# EAGLE design bits (EAGLE 7.6.0)
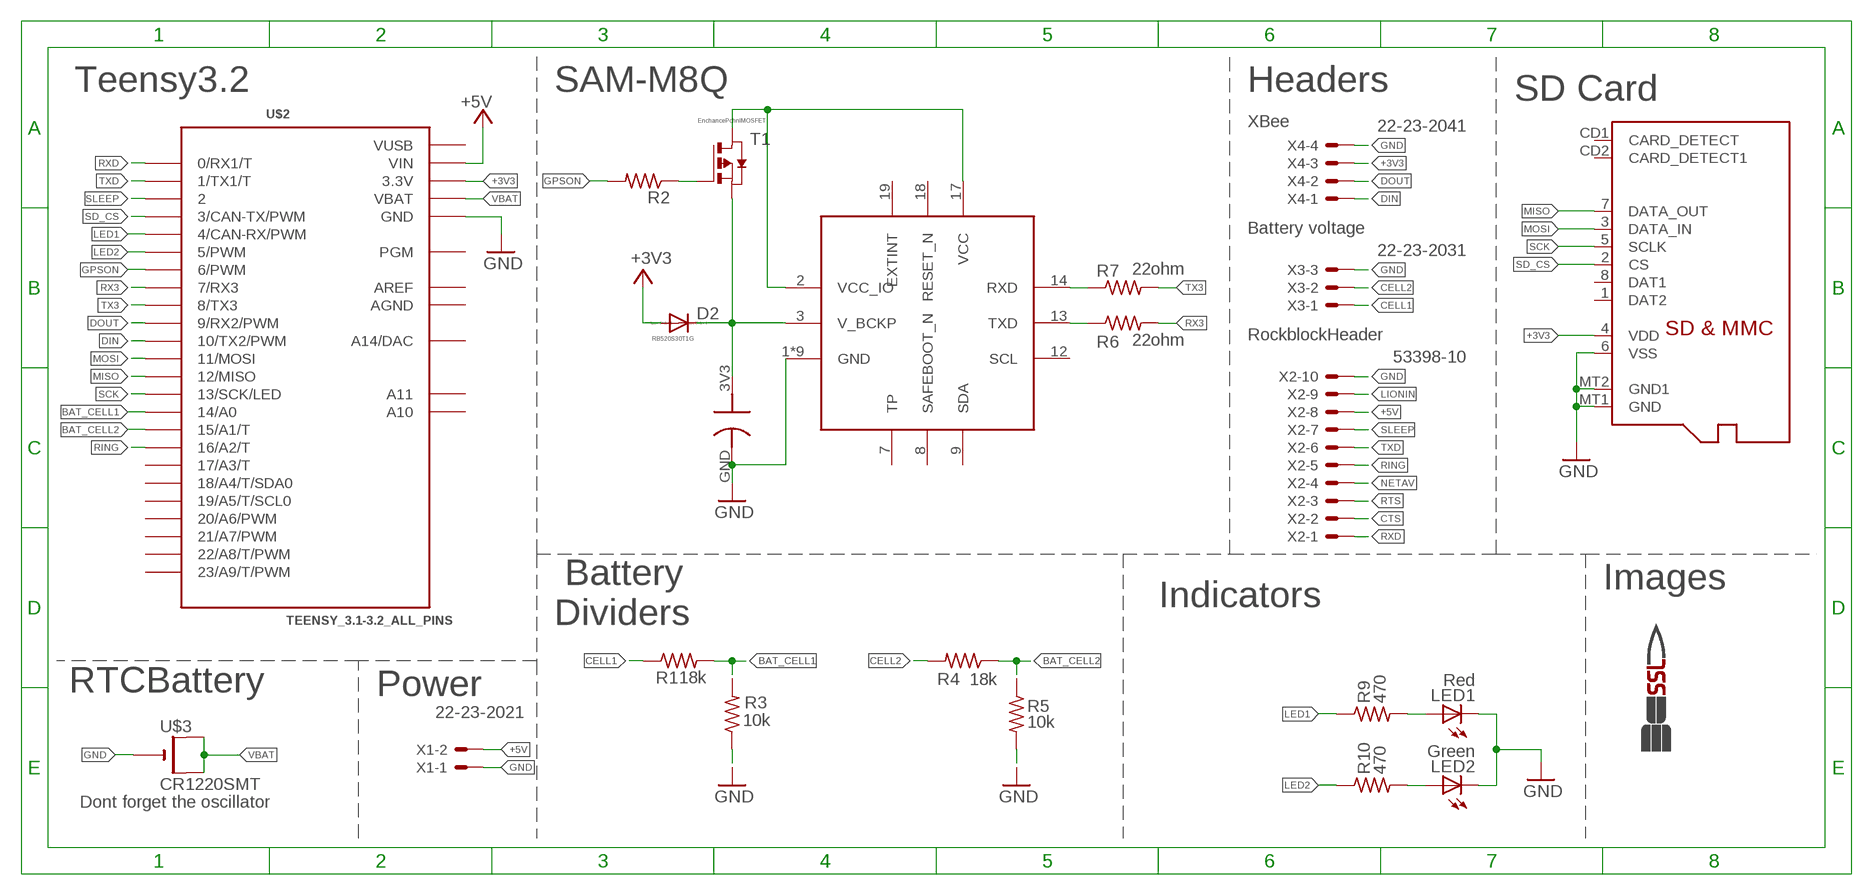
[diagram p0: schematic, sheet 1]

## Parts
C1  0.2F elna supercap  DCK-3RE204T614-ES  [ELNASUPERCAP]
D2  RB520S30T1G  DIODE-SOD523  [SOD523]
IC1  SAM-M8Q  [SAM-M8Q]
IMAG1  SSL.3IN_SILK  [SSL_SILK_.3IN]
LED1  Red  LEDCHIP-LED0603  [CHIP-LED0603]
LED2  Green  LEDCHIP-LED0603  [CHIP-LED0603]
R1  18k  R-US_R0603  [R0603]
R2  R-US_R0603  [R0603]
R3  10k  R-US_R0603  [R0603]
R4  18k  R-US_R0603  [R0603]
R5  10k  R-US_R0603  [R0603]
R6  22ohm  R-US_R0603  [R0603]
R7  22ohm  R-US_R0603  [R0603]
R9  470  R-US_R0603  [R0603]
R10  470  R-US_R0603  [R0603]
T1  EnchancePchnlMOSFET  PMOSSOT23  [SOT-23]
U$1  MICROSD  [MICROSD]
U$2  TEENSY_3.1-3.2_ALL_PINS  [TEENSY_3.0-3.2&LC_ALL_PINS]
U$3  CR1220SMT  [CR1220-SMD]
X1  22-23-2021  [22-23-2021]
X2  53398-10  [53398-10]
X3  22-23-2031  [22-23-2031]
X4  22-23-2041  [22-23-2041]

## Nets
+3V3: D2.A U$1.4(VDD) U$2.3.3V U$2.3.3V1(3.3V) X4.3
+5V: U$2.VIN X1.2 X2.8
BAT_CELL1: R1.2 R3.2 U$2.14/A0
BAT_CELL2: R4.1 R5.1 U$2.15/A1(15/A1/T)
CELL1: R1.1 X3.1
CELL2: R4.2 X3.2
CTS: X2.2
DIN: U$2.10(10/TX2/PWM) X4.1
DOUT: U$2.9(9/RX2/PWM) X4.2
GND: C1.GND IC1.1(GND) IC1.4(GND) IC1.5(GND) IC1.6(GND) IC1.10(GND) IC1.11(GND) IC1.15(GND) IC1.16(GND) IC1.20(GND) LED1.C LED2.C R3.1 R5.2 U$1.6(VSS) U$1.MT1(GND) U$1.MT2(GND1) U$2.GND U$2.GND1(GND) U$3.- X1.1 X2.10 X3.3 X4.4
GPS3V3: C1.3V3 D2.C IC1.3(V_BCKP) T1.2(S)
GPSON: R2.2 U$2.6(6/PWM)
LED1: R9.1 U$2.4(4/CAN-RX/PWM)
LED2: R10.1 U$2.5(5/PWM)
LIONIN: X2.9
MISO: U$1.7(DATA_OUT) U$2.12(12/MISO)
MOSI: U$1.3(DATA_IN) U$2.11(11/MOSI)
N$4: R2.1 T1.3(G)
N$5: LED2.A R10.2
N$6: LED1.A R9.2
N$7: IC1.14(RXD) R7.1
N$8: IC1.13(TXD) R6.1
N$10: IC1.2(VCC_IO) IC1.17(VCC) T1.1(D)
NETAV: X2.4
RING: U$2.16/A2(16/A2/T) X2.5
RTS: X2.3
RX3: R6.2 U$2.7(7/RX3)
RXD: U$2.0(0/RX1/T) X2.1
SCK: U$1.5(SCLK) U$2.13(13/SCK/LED)
SD_CS: U$1.2(CS) U$2.3(3/CAN-TX/PWM)
SLEEP: U$2.2 X2.7
TX3: R7.2 U$2.8(8/TX3)
TXD: U$2.1(1/TX1/T) X2.6
VBAT: U$2.VBAT U$3.+$1(+) U$3.+$2(+1)
Unconnected: IC1.7(TP) IC1.8(SAFEBOOT_N) IC1.9(SDA) IC1.12(SCL) IC1.18(RESET_N) IC1.19(EXTINT) U$1.1(DAT2) U$1.8(DAT1) U$1.CD1(CARD_DETECT) U$1.CD2(CARD_DETECT1) U$2.17/A3(17/A3/T) U$2.18/A4(18/A4/T/SDA0) U$2.19/A5(19/A5/T/SCL0) U$2.20/A6(20/A6/PWM) U$2.21/A7(21/A7/PWM) U$2.22/A8(22/A8/T/PWM) U$2.23/A9(23/A9/T/PWM) U$2.A10 U$2.A11 U$2.PGM U$2.RESET/DAC(A14/DAC)

## Notes on the sheet
- Teensy3.2 | SAM-M8Q | Headers | SD Card
- XBee
- Battery voltage
- RockblockHeader
- Images
- Indicators
- Battery
  Dividers
- RTCBattery | Power
- Dont forget the oscillator

## Power pins joined to a net without a drawn wire
AGND: U$2.AGND
AREF: U$2.AREF
VUSB: U$2.VUSB

## Library data of the parts
C1 = jmolterLib:DCK-3RE204T614-ES: ELNA Supercapacitor 3.3V max DCK-3R3E204T614-E 0.2F DCK-3R3E404T614-E 0.4F
D2 = diode:DIODE-: DIODE
IC1 = ubloxLib:SAM-M8Q: u-blox SAM GNSS antenna module
IMAG1 = images:SSL
LED1 LED2 = led:LED: LED OSRAM: - CHIPLED LG R971, LG N971, LY N971, LG Q971, LY Q971, LO R971, LY R971 LH N974, LH R974 LS Q976, LO Q976, LY Q976 LO Q996 - Hyper CHIPLED LW Q18S LB Q993, LB Q99A, LB R99A - SideLED LS A670, LO A670, LY A670, LG A670, LP A670 LB A673, LV A673, LT A673, LW A673 LH A674 LY A675 LS A676, LA A676, LO A676, LY A676, LW A676 LS A679, LY A679, LG A679 - Hyper Micro SIDELED® LS Y876, LA Y876, LO Y876, LY Y876 LT Y87S - SmartLED LW L88C, LW L88S LB L89C, LB L89S, LG L890 LS L89K, LO L89K, LY L89K LS L896, LA L896, LO L896, LY L896 - TOPLED LS T670, LO T670, LY T670, LG T670, LP T670 LSG T670, LSP T670, LSY T670, LOP T670, LYG T670 LG T671, LOG T671, LSG T671 LB T673, LV T673, LT T673, LW T673 LH T674 LS T676, LA T676, LO T676, LY T676, LB T676, LH T676, LSB T676, LW T676 LB T67C, LV T67C, LT T67C, LS T67K, LO T67K, LY T67K, LW E67C LS E67B, LA E67B, LO E67B, LY E67B, LB E67C, LV E67C, LT E67C LW T67C LS T679, LY T679, LG T679 LS T770, LO T770, LY T770, LG T770, LP T770 LB T773, LV T773, LT T773, LW T773 LH T774 LS E675, LA E675, LY E675, LS T675 LS T776, LA T776, LO T776, LY T776, LB T776 LHGB T686 LT T68C, LB T68C - Hyper Mini TOPLED® LB M676 - Mini TOPLED Santana® LG M470 LS M47K, LO M47K, LY M47K Source: http://www.osram.convergy.de LUXEON: - LUMILED® LXK2-PW12-R00, LXK2-PW12-S00, LXK2-PW14-U00, LXK2-PW14-V00 LXK2-PM12-R00, LXK2-PM12-S00, LXK2-PM14-U00 LXK2-PE12-Q00, LXK2-PE12-R00, LXK2-PE12-S00, LXK2-PE14-T00, LXK2-PE14-U00 LXK2-PB12-K00, LXK2-PB12-L00, LXK2-PB12-M00, LXK2-PB14-N00, LXK2-PB14-P00, LXK2-PB14-Q00 LXK2-PR12-L00, LXK2-PR12-M00, LXK2-PR14-Q00, LXK2-PR14-R00 LXK2-PD12-Q00, LXK2-PD12-R00, LXK2-PD12-S00 LXK2-PH12-R00, LXK2-PH12-S00 LXK2-PL12-P00, LXK2-PL12-Q00, LXK2-PL12-R00 Source: www.luxeon.com KINGBRIGHT: KA-3528ASYC Source: www.kingbright.com
R1-R7 R9 R10 = resistor:R-US_: RESISTOR, American symbol
T1 = zetex:PMOSSOT23: MOS FET; OC_FARNELL: unknown; OC_NEWARK: unknown
U$1 = adafruit:MICROSD: Micro-SD / Transflash card holder with SPI pinout For the 3M # 2908-05WB-MG and/or 4UCON #19656 push-push type
U$2 = Teensy_3_and_LC_Series_Boards_v1.4:TEENSY_3.1-3.2_ALL_PINS: Footprint for Teensy 3.1 or 3.2 board using all through-holes, i.e. the entire perimeter plus the 4 through-holes inboard (A10,A11,AREF, VUSB)
U$3 = adafruit:CR1220: CR1216/CR1220/CR1225 12mm 3V lithium coin cell Great for battery packup. Both SMT and THM holders. Note the THM package has the ground pads on both sides of the PCB so that the masks are the same - this reduces the cost
X1 = con-molex:22-23-2021: .100" (2.54mm) Center Header - 2 Pin; MF: MOLEX; MPN: 22-23-2021; OC_FARNELL: 1462926; OC_NEWARK: 25C3832
X2 = con-molex:53?-10: CONNECTOR wire to board 1.25 mm (.049 inch) pitch header; MF: MOLEX; MPN: 53398-1071; OC_FARNELL: unknown; OC_NEWARK: 59J0425
X3 = con-molex:22-23-2031: .100" (2.54mm) Center Header - 3 Pin; MF: MOLEX; MPN: 22-23-2031; OC_FARNELL: 1462950; OC_NEWARK: 30C0862
X4 = con-molex:22-23-2041: .100" (2.54mm) Center Header - 4 Pin; MF: MOLEX; MPN: 22-23-2041; OC_FARNELL: 1462920; OC_NEWARK: 38C0355

## Board
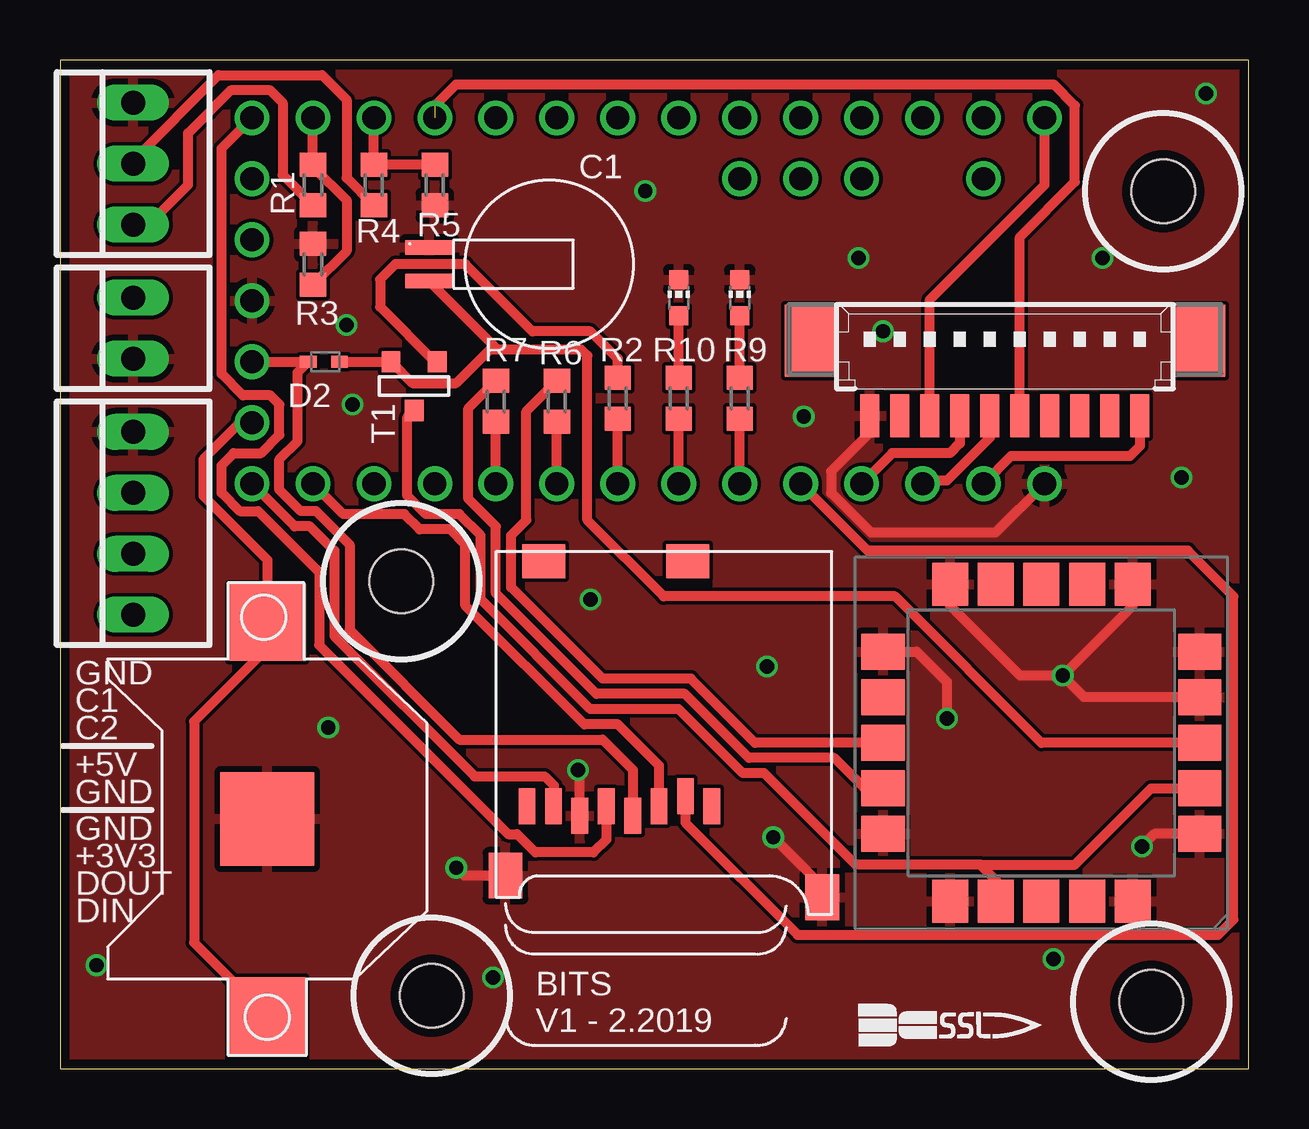
[diagram p1: board, top side]
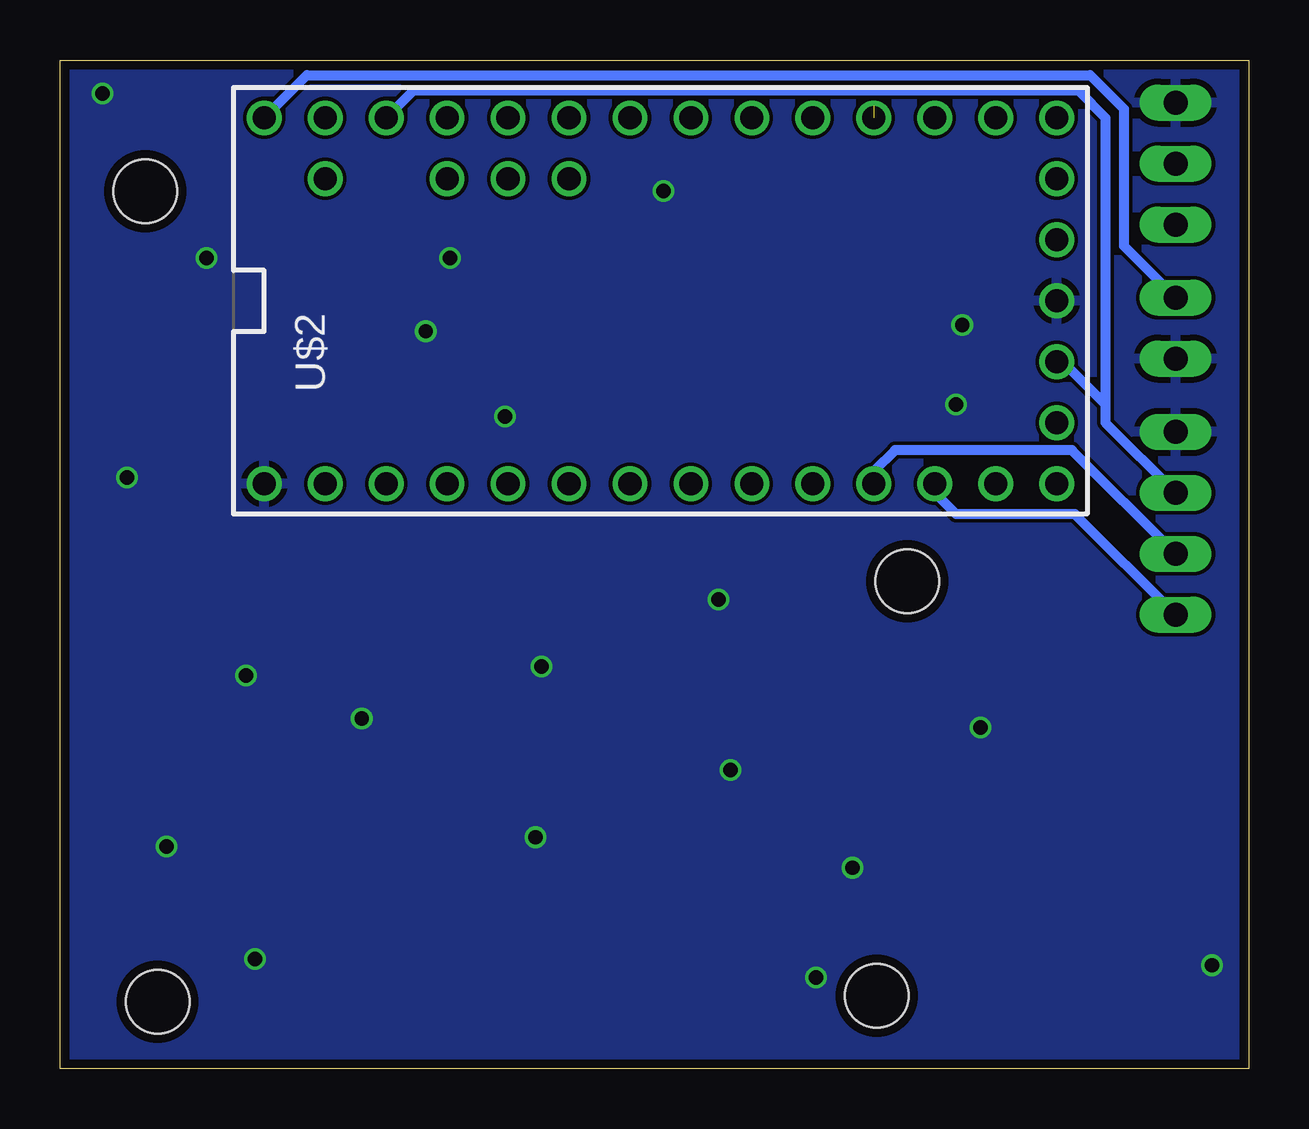
[diagram p2: board, bottom side, seen from below]

Size 49.53 x 42.04 mm. Coordinates in mm from the lower left corner, seen from the top.
Outline: 0,0 49.53,0 49.53,42.04 0,42.04 0,0
Copper layers (1*16): Top 0.035559375mm / dielectric 1.6mm / Bottom 0.035559375mm
Design rules "oshpark-2layer": minimum track width 6mil, minimum drill 10mil, track to track 6mil, track to pad 6mil, pad to pad 6mil, via to via 6mil, smd to smd 6mil, copper to edge 15mil, drill to drill 6mil, minimum pad ring 5mil, minimum via ring 5mil, stop-mask expansion 2.5mil, vias tented up to drill 0mil, thermal gap 10mil
Holes 2.65 mm at 14.22,20.32 15.49,3.05 45.47,2.79 45.97,36.58

### Footprints (pad centres in the part's own frame; a part is rotated, then mirrored left to right if it is on the bottom)
ELNASUPERCAP = smd 0.6 x 2: 3V3 0.7,-1.5; GND -0.7,-1.5
SOD523 = smd 0.7 x 0.5: A 0.7,0; C -0.6,0
SAM-M8Q = smd 1.8 x 1.5: 1 -6.6,3.8; 2 -6.6,1.9; 3 -6.6,0; 4 -6.6,-1.9; 5 -6.6,-3.8; 11 6.6,-3.8; 12 6.6,-1.9; 13 6.6,0; 14 6.6,1.9; 15 6.6,3.8 | smd 1.5 x 1.8: 6 -3.8,-6.6; 7 -1.9,-6.6; 8 0,-6.6; 9 1.9,-6.6; 10 3.8,-6.6; 16 3.8,6.6; 17 1.9,6.6; 18 0,6.6; 19 -1.9,6.6; 20 -3.8,6.6
CHIP-LED0603 = smd 0.8 x 0.8: A 0,-0.75; C 0,0.75
R0603 = smd 1 x 1.1: 1 -0.85,0; 2 0.85,0
SOT-23 = smd 0.787 x 0.889: 1 0.025,-1.016; 2 -0.94,1.016; 3 0.991,1.016
MICROSD = smd 0.7 x 1.5: 1 9,-10.64; 2 7.9,-10.24; 3 6.8,-10.64; 4 5.7,-11.04; 5 4.6,-10.64; 6 3.5,-11.04; 7 2.4,-10.64; 8 1.3,-10.64 | smd 1.8 x 1.4: CD1 2,-0.44; CD2 8,-0.44 | smd 1.4 x 1.9: MT1 0.4,-13.54; MT2 13.6,-14.44
TEENSY_3.0-3.2&LC_ALL_PINS = drill 0.965: 0 -7.62,13.97; 1 -7.62,11.43; 2 -7.62,8.89; 3 -7.62,6.35; 3.3V 7.62,11.43; 3.3V1 -2.54,-16.51; 4 -7.62,3.81; 5 -7.62,1.27; 6 -7.62,-1.27; 7 -7.62,-3.81; 8 -7.62,-6.35; 9 -7.62,-8.89; 10 -7.62,-11.43; 11 -7.62,-13.97; 12 -7.62,-16.51; 13 7.62,-16.51; 14/A0 7.62,-13.97; 15/A1 7.62,-11.43; 16/A2 7.62,-8.89; 17/A3 7.62,-6.35; 18/A4 7.62,-3.81; 19/A5 7.62,-1.27; 20/A6 7.62,1.27; 21/A7 7.62,3.81; 22/A8 7.62,6.35; 23/A9 7.62,8.89; A10 5.08,6.35; A11 5.08,3.81; AGND 7.62,13.97; AREF 5.08,8.89; GND -7.62,16.51; GND1 0,-16.51; PGM 2.54,-16.51; RESET/DAC 5.08,-16.51; VBAT -5.08,-16.51; VIN 7.62,16.51; VUSB 5.08,13.97
CR1220-SMD = smd 3.2 x 3.2: +$1 -8.2,0; +$2 8.2,0 | smd 3.9 x 3.9: - 0,0
22-23-2021 = drill 1 long: 1 -1.27,0; 2 1.27,0
53398-10 = smd 0.8 x 1.8: 1 5.625,-2.5; 2 4.375,-2.5; 3 3.125,-2.5; 4 1.875,-2.5; 5 0.625,-2.5; 6 -0.625,-2.5; 7 -1.875,-2.5; 8 -3.125,-2.5; 9 -4.375,-2.5; 10 -5.625,-2.5 | smd 2.1 x 3: S1 8.125,0.625; S2 -8.125,0.625
22-23-2031 = drill 1 long: 1 -2.54,0; 2 0,0; 3 2.54,0
22-23-2041 = drill 1 long: 1 -3.81,0; 2 -1.27,0; 3 1.27,0; 4 3.81,0

### Placement (x,y rotation side)
C1  16.89,33.53 270 top
D2  11.05,29.46 180 top
IC1  40.89,13.59 180 top
IMAG1  33.27,3.05 270 top
LED1  28.32,32.13 0 top
LED2  25.78,32.13 0 top
R1  10.54,36.83 90 top
R2  23.24,27.94 270 top
R3  10.54,33.53 270 top
R4  13.08,36.83 270 top
R5  15.62,36.83 270 top
R6  20.7,27.81 270 top
R7  18.16,27.81 270 top
R9  28.32,27.94 90 top
R10  25.78,27.94 90 top
T1  14.73,28.45 0 top
U$1  18.16,21.59 0 top
U$2  24.51,32 90 bottom
U$3  8.64,10.41 90 top
X1  3.05,30.86 90 top
X2  39.37,29.72 0 top
X3  3.05,37.72 90 top
X4  3.05,22.73 90 top

### Tracks (layer width: path | path; a pad name or v marks a point on that pad's centre or on a via)
+3V3
  Top 0.406: U$2.3.3V1 D2.A 9.91,29.02 9.91,26.16 9.14,25.4 9.14,24.13 10.03,23.24 10.67,23.24 12.06,21.84 12.06,18.29 16.64,13.72 22.61,13.72 23.88,12.45 23.88,10.56 U$1.4
  Bottom 0.406: U$2.3.3V 34.8,40.77 7.11,40.77 5.97,39.62 5.97,27.69 | U$2.3.3V1 7.75,29.46 5.97,27.69 | X4.3 5.97,26.92 5.97,27.69
+5V
  Top 0.406: X2.8 36.24,32.05 41.02,36.83 U$2.VIN
  Bottom 0.406: U$2.VIN 39.24,41.4 6.6,41.4 5.21,40.01 5.21,34.29 X1.2
BAT_CELL1
  Top 0.406: U$2.14/A0 R1.2 10.54,37.59 11.94,36.2 11.94,34.08 R3.2
BAT_CELL2
  Top 0.406: U$2.15/A1 R4.1 R5.1
CELL1
  Top 0.406: X3.1 3.68,35.18 5.33,36.83 5.33,38.99 7.11,40.77 8.76,40.77 9.27,40.26 9.27,37.25 R1.1
CELL2
  Top 0.406: R4.2 11.94,37.12 11.94,40.39 10.92,41.4 6.6,41.4 3.05,37.85 X3.2
DIN
  Bottom 0.406: X4.1 7.24,23.11 12.19,23.11 13.08,24 U$2.10
DOUT
  Bottom 0.406: X4.2 7.37,25.78 14.73,25.78 15.62,24.89 U$2.9
GND  (via drill 0.6)
  Top 0.406: X2.10 33.74,26.51 32.13,24.89 32.13,24 33.78,22.35 38.99,22.35 U$2.GND | v41.78,16.38 40.01,16.38 37.08,19.3 37.08,20.18 IC1.10 | IC1.6 44.69,19.29 v41.78,16.38 | IC1.4 42.68,15.49 v41.78,16.38 | IC1.1 45.6,9.79 v45.09,9.27 | IC1.11 35.7,17.39 36.96,16.13 v36.96,14.61 | U$1.MT2 31.76,7.61 v29.72,9.65 | U$1.6 21.66,12.38 v21.59,12.45 | U$1.MT1 16.84,8.05 v16.51,8.38
  other vias: 11.18,14.22 1.52,4.32 41.4,4.57 18.03,3.81 46.74,24.64 30.99,27.18 34.29,30.73 24.38,36.58 33.27,33.78 11.94,30.99 12.19,27.69 29.46,16.76 22.1,19.56 43.43,33.78 47.75,40.64
  pour Bottom: 50.8,43.94 -3.3,43.94 -3.3,-0.76 50.8,-0.76
  pour Top: -1.52,42.67 53.09,42.67 53.09,-1.52 -1.52,-1.52
GPS3V3
  Top 0.406: IC1.3 40.89,13.59 34.8,19.68 25.15,19.68 21.97,22.86 21.97,29.72 21.72,29.97 18.25,29.97 | 18.25,29.97 C1.3V3 | 18.25,29.97 17.91,29.97 16.51,28.57 14.68,28.57 T1.2 D2.C
GPSON
  Top 0.406: U$2.6 R2.2
LED1
  Top 0.406: U$2.4 R9.1
LED2
  Top 0.406: U$2.5 R10.1
MISO
  Top 0.406: U$2.12 9.78,22.61 10.41,22.61 11.43,21.59 11.43,18.03 17.27,12.19 20.19,12.19 20.57,11.81 20.57,10.96 U$1.7
MOSI
  Top 0.406: U$1.3 24.96,12.63 23.24,14.35 21.84,14.35 16.89,19.3 16.89,21.84 16.26,22.48 14.99,22.48 14.35,23.11 11.81,23.11 U$2.11
N$4
  Top 0.406: R2.1 23.24,29.59 22.1,30.73 19.68,30.73 16.89,33.53 13.97,33.53 13.34,32.89 13.34,31.75 15.62,29.46 T1.3
N$5
  Top 0.406: R10.2 LED2.A
N$6
  Top 0.406: R9.2 LED1.A
N$7
  Top 0.406: IC1.14 33.52,11.69 32.26,12.95 28.7,12.95 26.04,15.62 22.35,15.62 18.16,19.81 18.16,22.61 17.02,23.75 17.02,27.52 R7.1
N$8
  Top 0.406: IC1.13 28.96,13.59 26.29,16.26 22.61,16.26 18.8,20.07 18.8,22.23 19.43,22.86 19.43,27.39 R6.1
N$10
  Top 0.406: IC1.17 38.99,7.87 38.35,8.51 | 38.35,8.51 42.29,8.51 45.47,11.68 IC1.2 | 38.35,8.51 33.15,8.51 29.34,12.32 28.45,12.32 25.78,14.99 22.1,14.99 17.53,19.56 17.53,22.23 16.64,23.11 15.24,23.11 14.48,23.88 14.48,27.15 T1.1
RING  (1 unrouted)
  Top 0.406: 15.62,40.13 16.51,41.02 41.4,41.02 42.29,40.13 42.29,36.96 39.99,34.66 X2.5
RX3
  Top 0.406: U$2.7 R6.2
RXD
  Top 0.406: X2.1 44.99,25.95 44.58,25.53 39.62,25.53 U$2.0
SCK
  Top 0.406: U$1.5 22.76,9.55 22.23,9.02 19.81,9.02 19.05,9.78 18.67,9.78 10.79,17.65 10.79,20.7 8.26,23.24 7.49,23.24 6.73,24 6.73,25.15 7.24,25.65 8.38,25.65 9.14,26.42 9.14,27.69 8.76,28.07 7.62,28.07 6.73,28.96 6.73,38.35 U$2.13
SD_CS
  Top 0.406: U$1.2 26.06,10.26 30.73,5.59 48.26,5.59 48.9,6.22 48.9,19.68 46.99,21.59 33.66,21.59 U$2.3
SLEEP
  Top 0.406: X2.7 37.49,26.07 37.08,25.65 34.67,25.65 U$2.2
TX3
  Top 0.406: U$2.8 R7.2
TXD
  Top 0.406: X2.6 38.74,26.3 36.96,24.51 36.07,24.51 U$2.1
VBAT
  Top 0.406: U$2.VBAT 7.49,26.92 5.97,25.4 5.97,23.88 8.64,21.21 U$3.+$2 8.64,17.53 5.59,14.48 5.59,5.26 U$3.+$1

### Text on the board
tPlace: GND | C1 | C2 | +5V | GND | GND | +3V3 | DOUT | DIN | BITS | V1 - 2.2019